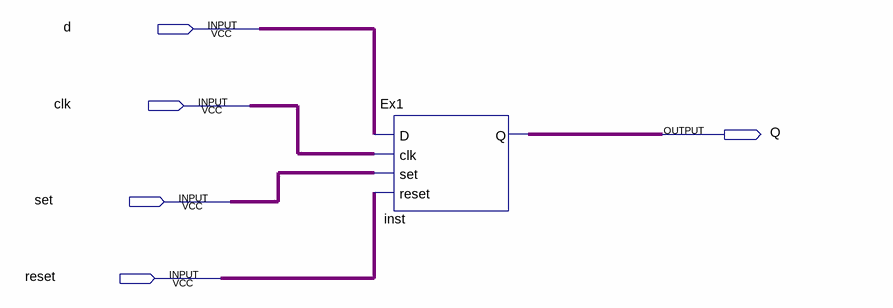
[diagram p0: schematic sheet]
// Quartus schematic Ex1_SCHEME.bdf as structural Verilog: 1 symbols, 5 pins
module Ex1_SCHEME (
  input  d,
  input  clk,
  input  set,
  input  reset,
  output Q
);

  Ex1 inst (.D(d), .clk(clk), .set(set), .reset(reset), .Q(Q));
endmodule
